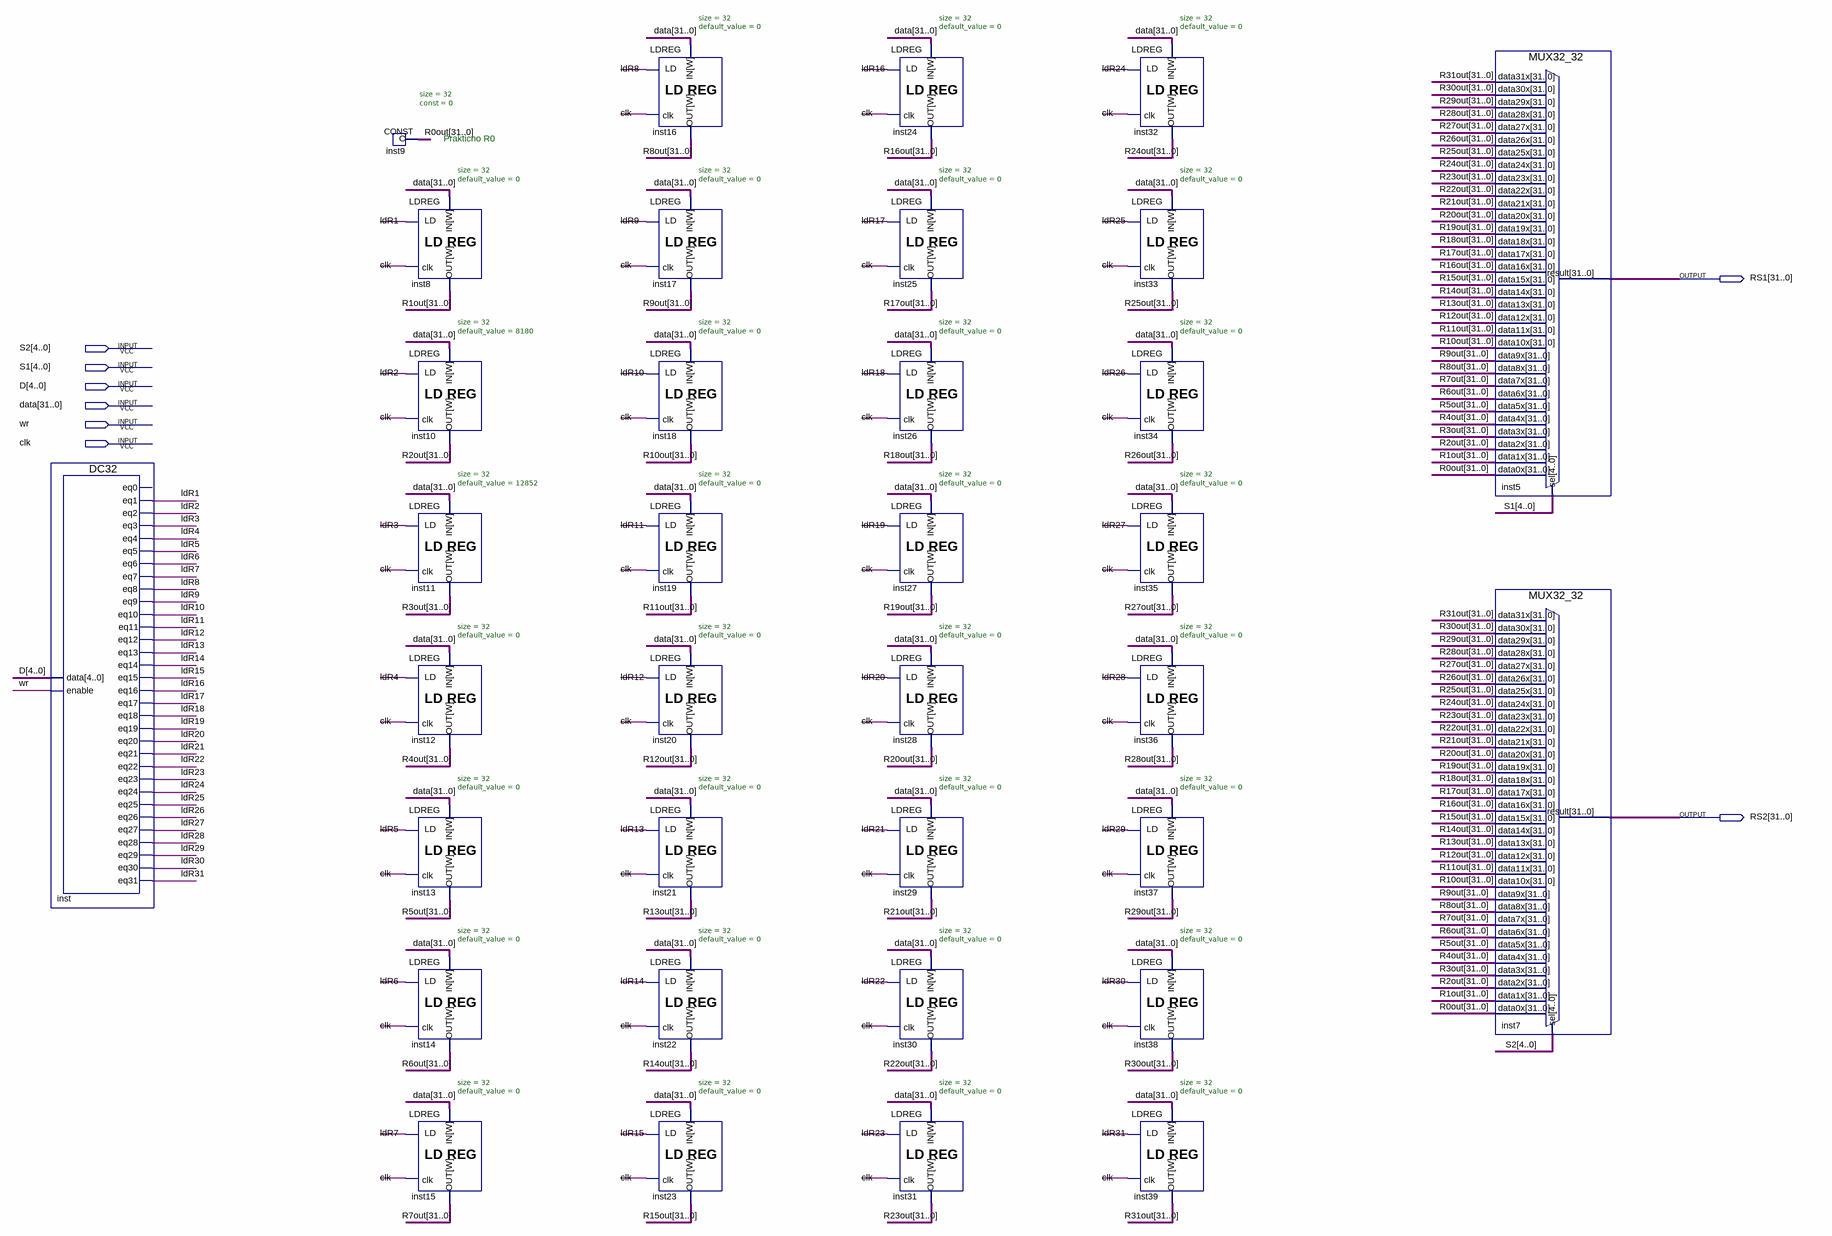
[diagram p0: schematic sheet]
// Quartus schematic RegFile.bdf as structural Verilog: 35 symbols, 8 pins
module RegFile (
  input  [4:0] S2,
  input  [4:0] S1,
  input  [4:0] D,
  input  [31:0] data,
  input  wr,
  input  clk,
  output [31:0] RS1,
  output [31:0] RS2
);

  wire ldR1, ldR2, ldR3, ldR4, ldR5, ldR6, ldR7, ldR8, ldR9, ldR10, ldR11, ldR12, ldR13, ldR14, ldR15, ldR16,
       ldR17, ldR18, ldR19, ldR20, ldR21, ldR22, ldR23, ldR24, ldR25, ldR26, ldR27, ldR28, ldR29, ldR30,
       ldR31;
  wire [31:0] R0out, R1out, R2out, R3out, R4out, R5out, R6out, R7out, R8out, R9out, R10out, R11out, R12out,
       R13out, R14out, R15out, R16out, R17out, R18out, R19out, R20out, R21out, R22out, R23out, R24out,
       R25out, R26out, R27out, R28out, R29out, R30out, R31out;

  DC32 inst (
    .data(D), .enable(wr), .eq1(ldR1), .eq2(ldR2), .eq3(ldR3), .eq4(ldR4), .eq5(ldR5), .eq6(ldR6),
    .eq7(ldR7), .eq8(ldR8), .eq9(ldR9), .eq10(ldR10), .eq11(ldR11), .eq12(ldR12), .eq13(ldR13), .eq14(ldR14),
    .eq15(ldR15), .eq16(ldR16), .eq17(ldR17), .eq18(ldR18), .eq19(ldR19), .eq20(ldR20), .eq21(ldR21),
    .eq22(ldR22), .eq23(ldR23), .eq24(ldR24), .eq25(ldR25), .eq26(ldR26), .eq27(ldR27), .eq28(ldR28),
    .eq29(ldR29), .eq30(ldR30), .eq31(ldR31));  // open: eq0
  CONST #(.size(32), .\const (0)) inst9 (.data(R0out));
  LDREG #(.size(32), .default_value(0)) inst8 (.clk(clk), .data_in(data), .ld(ldR1), .data_out(R1out));
  LDREG #(.size(32), .default_value(8180)) inst10 (.clk(clk), .data_in(data), .ld(ldR2), .data_out(R2out));
  LDREG #(.size(32), .default_value(12852)) inst11 (.clk(clk), .data_in(data), .ld(ldR3), .data_out(R3out));
  LDREG #(.size(32), .default_value(0)) inst12 (.clk(clk), .data_in(data), .ld(ldR4), .data_out(R4out));
  LDREG #(.size(32), .default_value(0)) inst13 (.clk(clk), .data_in(data), .ld(ldR5), .data_out(R5out));
  LDREG #(.size(32), .default_value(0)) inst14 (.clk(clk), .data_in(data), .ld(ldR6), .data_out(R6out));
  LDREG #(.size(32), .default_value(0)) inst15 (.clk(clk), .data_in(data), .ld(ldR7), .data_out(R7out));
  LDREG #(.size(32), .default_value(0)) inst16 (.clk(clk), .data_in(data), .ld(ldR8), .data_out(R8out));
  LDREG #(.size(32), .default_value(0)) inst17 (.clk(clk), .data_in(data), .ld(ldR9), .data_out(R9out));
  LDREG #(.size(32), .default_value(0)) inst18 (.clk(clk), .data_in(data), .ld(ldR10), .data_out(R10out));
  LDREG #(.size(32), .default_value(0)) inst19 (.clk(clk), .data_in(data), .ld(ldR11), .data_out(R11out));
  LDREG #(.size(32), .default_value(0)) inst20 (.clk(clk), .data_in(data), .ld(ldR12), .data_out(R12out));
  LDREG #(.size(32), .default_value(0)) inst21 (.clk(clk), .data_in(data), .ld(ldR13), .data_out(R13out));
  LDREG #(.size(32), .default_value(0)) inst22 (.clk(clk), .data_in(data), .ld(ldR14), .data_out(R14out));
  LDREG #(.size(32), .default_value(0)) inst23 (.clk(clk), .data_in(data), .ld(ldR15), .data_out(R15out));
  LDREG #(.size(32), .default_value(0)) inst24 (.clk(clk), .data_in(data), .ld(ldR16), .data_out(R16out));
  LDREG #(.size(32), .default_value(0)) inst25 (.clk(clk), .data_in(data), .ld(ldR17), .data_out(R17out));
  LDREG #(.size(32), .default_value(0)) inst26 (.clk(clk), .data_in(data), .ld(ldR18), .data_out(R18out));
  LDREG #(.size(32), .default_value(0)) inst27 (.clk(clk), .data_in(data), .ld(ldR19), .data_out(R19out));
  LDREG #(.size(32), .default_value(0)) inst28 (.clk(clk), .data_in(data), .ld(ldR20), .data_out(R20out));
  LDREG #(.size(32), .default_value(0)) inst29 (.clk(clk), .data_in(data), .ld(ldR21), .data_out(R21out));
  LDREG #(.size(32), .default_value(0)) inst30 (.clk(clk), .data_in(data), .ld(ldR22), .data_out(R22out));
  LDREG #(.size(32), .default_value(0)) inst31 (.clk(clk), .data_in(data), .ld(ldR23), .data_out(R23out));
  LDREG #(.size(32), .default_value(0)) inst32 (.clk(clk), .data_in(data), .ld(ldR24), .data_out(R24out));
  LDREG #(.size(32), .default_value(0)) inst33 (.clk(clk), .data_in(data), .ld(ldR25), .data_out(R25out));
  LDREG #(.size(32), .default_value(0)) inst34 (.clk(clk), .data_in(data), .ld(ldR26), .data_out(R26out));
  LDREG #(.size(32), .default_value(0)) inst35 (.clk(clk), .data_in(data), .ld(ldR27), .data_out(R27out));
  LDREG #(.size(32), .default_value(0)) inst36 (.clk(clk), .data_in(data), .ld(ldR28), .data_out(R28out));
  LDREG #(.size(32), .default_value(0)) inst37 (.clk(clk), .data_in(data), .ld(ldR29), .data_out(R29out));
  LDREG #(.size(32), .default_value(0)) inst38 (.clk(clk), .data_in(data), .ld(ldR30), .data_out(R30out));
  LDREG #(.size(32), .default_value(0)) inst39 (.clk(clk), .data_in(data), .ld(ldR31), .data_out(R31out));
  MUX32_32 inst5 (
    .data31x(R31out), .data30x(R30out), .data29x(R29out), .data28x(R28out), .data27x(R27out),
    .data26x(R26out), .data25x(R25out), .data24x(R24out), .data23x(R23out), .data22x(R22out),
    .data21x(R21out), .data20x(R20out), .data19x(R19out), .data18x(R18out), .data17x(R17out),
    .data16x(R16out), .data15x(R15out), .data14x(R14out), .data13x(R13out), .data12x(R12out),
    .data11x(R11out), .data10x(R10out), .data9x(R9out), .data8x(R8out), .data7x(R7out), .data6x(R6out),
    .data5x(R5out), .data4x(R4out), .data3x(R3out), .data2x(R2out), .data1x(R1out), .data0x(R0out), .sel(S1),
    .result(RS1));
  MUX32_32 inst7 (
    .data31x(R31out), .data30x(R30out), .data29x(R29out), .data28x(R28out), .data27x(R27out),
    .data26x(R26out), .data25x(R25out), .data24x(R24out), .data23x(R23out), .data22x(R22out),
    .data21x(R21out), .data20x(R20out), .data19x(R19out), .data18x(R18out), .data17x(R17out),
    .data16x(R16out), .data15x(R15out), .data14x(R14out), .data13x(R13out), .data12x(R12out),
    .data11x(R11out), .data10x(R10out), .data9x(R9out), .data8x(R8out), .data7x(R7out), .data6x(R6out),
    .data5x(R5out), .data4x(R4out), .data3x(R3out), .data2x(R2out), .data1x(R1out), .data0x(R0out), .sel(S2),
    .result(RS2));

  // Notes on the sheet:
  //   Prakticno R0
endmodule
